# Altium schematic sheet LowLatch.SchDoc
size A
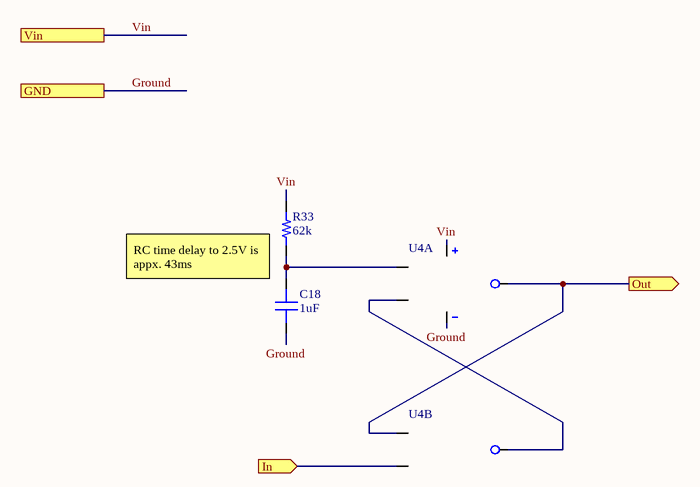
[diagram p0: LowLatch.SchDoc]

## Parts
C18  capacitance: 1uF  [0603]  (hidden comment: capacitor)
R33  62k  [RES 0603/1608]
U4  SN74LVC2G132DCUR  [R-PDSO-G8]  (value not drawn)  (parts A,B of 2)

## Ports
GND, In (in), Out (out), Vin

## Nets
Ground: C18.2 U4.4(GND) ; port GND
In: U4.6(2B) ; port In
Out: U4.5(2A) U4.7(1Y) ; port Out
Vin: R33.2 U4.8(Vcc) ; port Vin
NetC18_1: C18.1 R33.1 U4.1(1A)
NetU4_2: U4.2(1B) U4.3(2Y)

## Notes on the sheet
- RC time delay to 2.5V is appx. 43ms

## Library data of the parts
C18 = 1: Generic 0603 capacitor; id: 1; voltage: 50; dielectric: Ceramic; percent tolerance: 10; name: 0603 Capacitor; ESR: 1; package: 0603; quantity: 0
R33 = 1: id: 1; name: 0603 Resistor; percent tolerance: 5; resistance: 62k; package: 0603; quantity: 0
U4 = 12: SN74LVC2G132DCUR 2channel NAND Gate; id: 12; updatedby: Kevin; name: SN74LVC2G132DCUR; quantity: 0; link: https://www.digikey.com/product-detail/en/texas-instruments/SN74LVC2G132DCUR/296-18802-1-ND/863928